# EAGLE schematic circuit_layout (EAGLE 6.5.0)
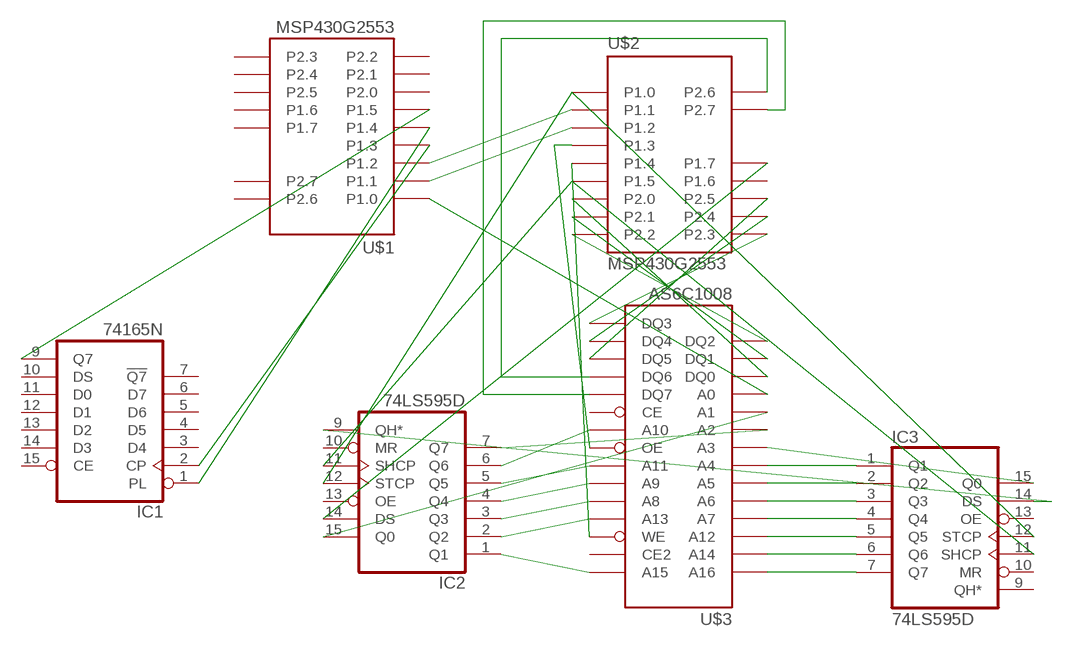
[diagram p0: schematic, sheet 1]

## Parts
IC1  74165N  [DIL16]
IC2  74LS595D  [SO16]
IC3  74LS595D  [SO16]
U$1  MSP430G2553  [MSP430G2553]
U$2  MSP430G2553  [MSP430G2553]
U$3  AS6C1008  [AS6C1008]

## Nets
N$1: IC3.7(Q7) U$3.P$17(A16)
N$2: IC3.6(Q6) U$3.P$15(A14)
N$3: IC3.5(Q5) U$3.P$13(A12)
N$4: IC3.4(Q4) U$3.P$8(A7)
N$5: IC3.3(Q3) U$3.P$7(A6)
N$6: IC3.2(Q2) U$3.P$6(A5)
N$7: IC3.1(Q1) U$3.P$5(A4)
N$8: IC3.15(Q0) U$3.P$4(A3)
N$9: IC2.1(Q1) U$3.P$16(A15)
N$10: IC2.2(Q2) U$3.P$14(A13)
N$11: IC2.3(Q3) U$3.P$9(A8)
N$12: IC2.4(Q4) U$3.P$10(A9)
N$13: IC2.5(Q5) U$3.P$12(A11)
N$14: IC2.6(Q6) U$3.P$11(A10)
N$15: IC2.7(Q7) U$3.P$3(A2)
N$16: IC2.15(Q0) U$3.P$2(A1)
N$17: U$2.P$9(P2.0) U$3.P$20(DQ0)
N$18: U$2.P$10(P2.1) U$3.P$21(DQ1)
N$19: U$2.P$11(P2.2) U$3.P$22(DQ2)
N$20: U$2.P$12(P2.3) U$3.P$23(DQ3)
N$21: U$2.P$13(P2.4) U$3.P$24(DQ4)
N$22: U$2.P$14(P2.5) U$3.P$25(DQ5)
N$23: U$2.P$15(P2.6) U$3.P$26(DQ6)
N$24: U$2.P$16(P2.7) U$3.P$27(DQ7)
N$25: IC2.9(QH*) IC3.14(DS)
N$26: IC2.11(SHCP) IC3.11(SHCP) U$2.P$6(P1.5)
N$27: U$2.P$5(P1.4) U$3.P$29(WE)
N$28: U$2.P$4(P1.3) U$3.P$28(OE)
N$29: U$1.P$3(P1.2) U$2.P$2(P1.1)
N$30: U$1.P$2(P1.1) U$2.P$3(P1.2)
N$31: IC2.12(STCP) IC3.12(STCP) U$2.P$1(P1.0)
N$32: U$1.P$1(P1.0) U$3.P$1(A0)
N$33: IC1.2(CP) U$1.P$4(P1.3)
N$34: IC1.1(PL) U$1.P$5(P1.4)
N$35: IC1.9(Q7) U$1.P$6(P1.5)
N$36: IC2.14(DS) U$2.P$8(P1.7)
Unconnected: IC1.3(D4) IC1.4(D5) IC1.5(D6) IC1.6(D7) IC1.7(!Q7) IC1.10(DS) IC1.11(D0) IC1.12(D1) IC1.13(D2) IC1.14(D3) IC1.15(CE) IC2.10(MR) IC2.13(OE) IC3.9(QH*) IC3.10(MR) IC3.13(OE) U$1.P$7(P1.6) U$1.P$8(P1.7) U$1.P$9(P2.0) U$1.P$10(P2.1) U$1.P$11(P2.2) U$1.P$12(P2.3) U$1.P$13(P2.4) U$1.P$14(P2.5) U$1.P$15(P2.6) U$1.P$16(P2.7) U$2.P$7(P1.6) U$3.P$18(CE) U$3.P$19(CE2)

## Power pins joined to a net without a drawn wire
GND: IC1.8(GND) IC2.8(GND) IC3.8(GND)
VCC: IC1.16(VCC) IC2.16(VCC) IC3.16(VCC)

## Library data of the parts
IC1 = 74xx-us:74*165: 8-bit parallel load SHIFT REGISTER
IC2 IC3 = 74xx-us:74*595: 8-bit SHIFT REGISTER, output latch
U$1 U$2 = MSP430G2553:MSP430G2553
U$3 = AS6C1008:AS6C1008